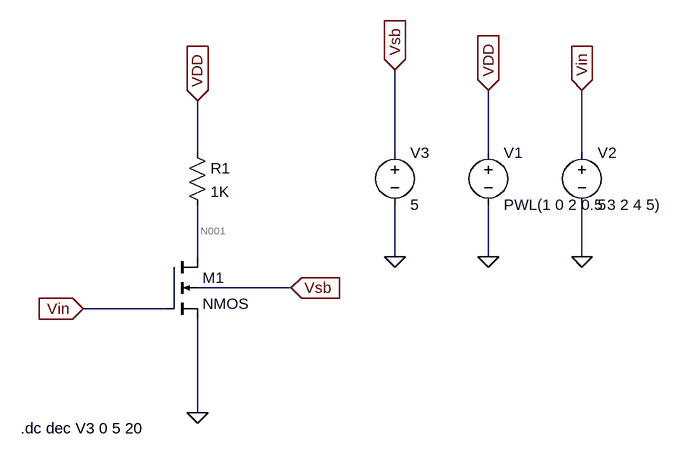
[diagram p0: schematic BackGate.asc]
BackGate.asc, the LTspice schematic file:
Version 4
SHEET 1 1112 680
WIRE 384 32 384 -48
WIRE 688 32 688 -96
WIRE 832 32 832 -64
WIRE 976 32 976 -64
WIRE 384 192 384 112
WIRE 688 192 688 112
WIRE 832 192 832 112
WIRE 976 192 976 112
WIRE 528 240 384 240
WIRE 336 272 208 272
WIRE 384 432 384 288
FLAG 384 -48 VDD
IOPIN 384 -48 In
FLAG 832 -64 VDD
IOPIN 832 -64 In
FLAG 832 192 0
FLAG 384 432 0
FLAG 976 192 0
FLAG 976 -64 Vin
IOPIN 976 -64 In
FLAG 208 272 Vin
IOPIN 208 272 In
FLAG 688 192 0
FLAG 688 -96 Vsb
IOPIN 688 -96 In
FLAG 528 240 Vsb
IOPIN 528 240 In
SYMBOL nmos4 336 192 R0
SYMATTR InstName M1
SYMBOL res 368 16 R0
SYMATTR InstName R1
SYMATTR Value 1K
SYMBOL voltage 832 16 R0
WINDOW 123 0 0 Left 0
WINDOW 39 0 0 Left 0
SYMATTR InstName V1
SYMATTR Value PWL(1 0 2 0.5 3 2 4 5)
SYMBOL voltage 976 16 R0
WINDOW 123 0 0 Left 0
WINDOW 39 0 0 Left 0
SYMATTR InstName V2
SYMATTR Value 5
SYMBOL voltage 688 16 R0
WINDOW 123 0 0 Left 0
WINDOW 39 0 0 Left 0
SYMATTR InstName V3
SYMATTR Value 5
TEXT 112 456 Left 2 !.dc dec V3 0 5 20

The netlist it stands for:
* BackGate.asc
M1 N001 Vin 0 Vsb NMOS
R1 VDD N001 1K
V1 VDD 0 PWL(1 0 2 0.5 3 2 4 5)
V2 Vin 0 5
V3 Vsb 0 5
.model NMOS NMOS
.model PMOS PMOS
.lib standard.mos
.dc dec V3 0 5 20
.backanno
.end

* Results of the author's LTspice run, read from the files saved beside the schematic
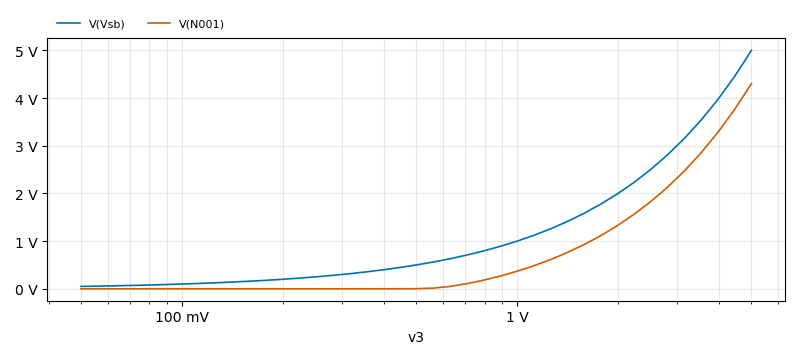
[diagram p1: DC transfer characteristic of BackGate.asc, plotted from the saved traces]
* DC transfer characteristic, 1 run:
*   V(Vsb): 50 mV at v3=50 mV, 5 V at v3=5 V, min 50 mV, max 5 V
*   V(N001): 99.19 pV at v3=50 mV, 4.303 V at v3=5 V, min 99.19 pV, max 4.303 V